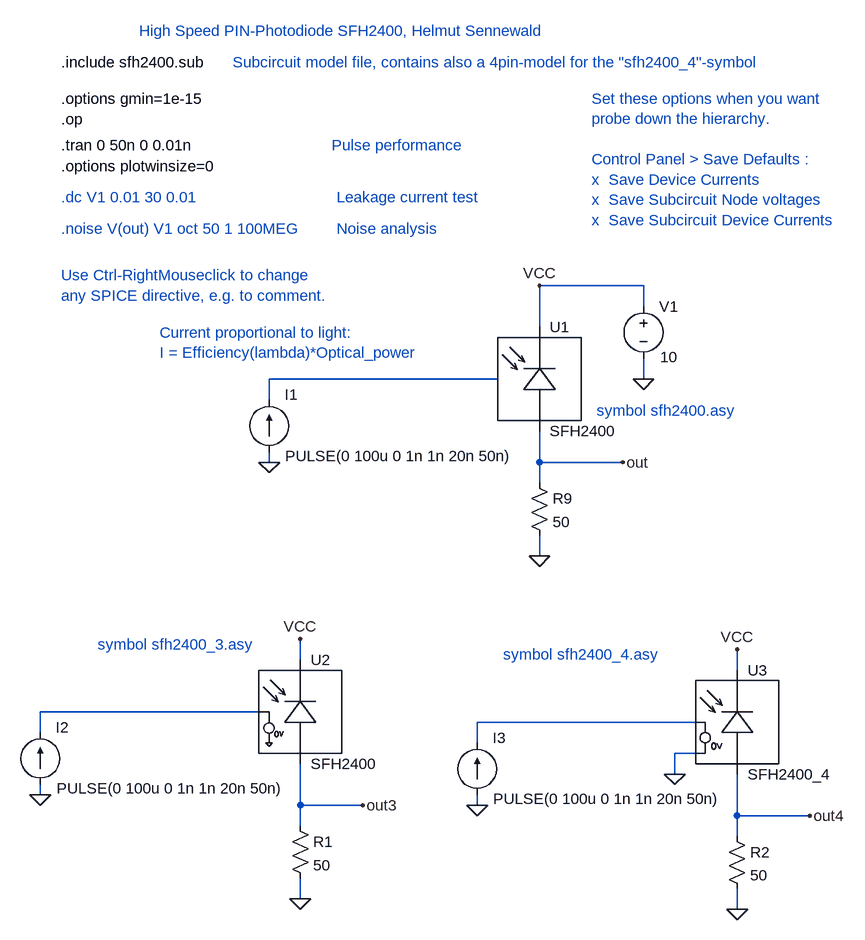
[diagram p0: schematic sfh2400_test1.asc]
sfh2400_test1.asc, the LTspice schematic file:
Version 4
SHEET 1 1668 1860
WIRE -1008 1072 -1008 1040
WIRE -1008 1168 -1008 1152
WIRE -672 1040 -1008 1040
WIRE -656 560 -656 528
WIRE -656 656 -656 640
WIRE -608 960 -608 928
WIRE -608 1184 -608 1120
WIRE -608 1216 -608 1184
WIRE -608 1328 -608 1296
WIRE -512 1184 -608 1184
WIRE -336 1088 -336 1056
WIRE -336 1184 -336 1168
WIRE -304 528 -656 528
WIRE -240 448 -240 384
WIRE -240 656 -240 608
WIRE -240 688 -240 656
WIRE -240 800 -240 768
WIRE -112 656 -240 656
WIRE -80 384 -240 384
WIRE -80 416 -80 384
WIRE -80 528 -80 496
WIRE -32 1136 -32 1104
WIRE 0 1056 -336 1056
WIRE 0 1104 -32 1104
WIRE 64 976 64 944
WIRE 64 1200 64 1136
WIRE 64 1232 64 1200
WIRE 64 1344 64 1312
WIRE 176 1200 64 1200
FLAG -80 528 0
FLAG -240 800 0
FLAG -112 656 out
FLAG -656 656 0
FLAG -240 384 VCC
FLAG 64 944 VCC
FLAG -608 928 VCC
FLAG -608 1328 0
FLAG -512 1184 out3
FLAG 64 1344 0
FLAG 176 1200 out4
FLAG -1008 1168 0
FLAG -336 1184 0
FLAG -32 1136 0
SYMBOL voltage -80 400 R0
WINDOW 123 24 44 Left 0
WINDOW 39 0 0 Left 0
WINDOW 3 26 94 Left 0
SYMATTR Value 10
SYMATTR InstName V1
SYMBOL res -256 672 R0
SYMATTR InstName R9
SYMATTR Value 50
SYMBOL current -656 640 M180
WINDOW 0 24 88 Left 0
WINDOW 3 25 -6 Left 0
WINDOW 123 0 0 Left 0
WINDOW 39 0 0 Left 0
SYMATTR InstName I1
SYMATTR Value PULSE(0 100u 0 1n 1n 20n 50n)
SYMBOL sfh2400 -240 528 R0
SYMATTR InstName U1
SYMBOL sfh2400_3 -608 1040 R0
SYMATTR InstName U2
SYMBOL sfh2400_4 64 1056 R0
SYMATTR InstName U3
SYMBOL res -624 1200 R0
SYMATTR InstName R1
SYMATTR Value 50
SYMBOL res 48 1216 R0
SYMATTR InstName R2
SYMATTR Value 50
SYMBOL current -1008 1152 M180
WINDOW 0 24 88 Left 0
WINDOW 3 25 -6 Left 0
WINDOW 123 0 0 Left 0
WINDOW 39 0 0 Left 0
SYMATTR InstName I2
SYMATTR Value PULSE(0 100u 0 1n 1n 20n 50n)
SYMBOL current -336 1168 M180
WINDOW 0 24 88 Left 0
WINDOW 3 25 -6 Left 0
WINDOW 123 0 0 Left 0
WINDOW 39 0 0 Left 0
SYMATTR InstName I3
SYMATTR Value PULSE(0 100u 0 1n 1n 20n 50n)
TEXT -976 128 Left 0 !.op
TEXT -976 96 Left 0 !.options gmin=1e-15
TEXT -976 296 Left 0 ;.noise V(out) V1 oct 50 1 100MEG
TEXT -976 168 Left 0 !.tran 0 50n 0 0.01n
TEXT -976 248 Left 0 ;.dc V1 0.01 30 0.01
TEXT -976 40 Left 0 !.include sfh2400.sub
TEXT -976 368 Left 0 ;Use Ctrl-RightMouseclick to change \nany SPICE directive, e.g. to comment.
TEXT -160 96 Left 0 ;Set these options when you want \nprobe down the hierarchy.\n \nControl Panel > Save Defaults : \nx  Save Device Currents\nx  Save Subcircuit Node voltages\nx  Save Subcircuit Device Currents
TEXT -856 -8 Left 0 ;High Speed PIN-Photodiode SFH2400, Helmut Sennewald
TEXT -824 456 Left 0 ;Current proportional to light:\nI = Efficiency(lambda)*Optical_power
TEXT -920 936 Left 0 ;symbol sfh2400_3.asy
TEXT -296 952 Left 0 ;symbol sfh2400_4.asy
TEXT -152 576 Left 0 ;symbol sfh2400.asy
TEXT -712 40 Left 0 ;Subcircuit model file, contains also a 4pin-model for the "sfh2400_4"-symbol
TEXT -560 168 Left 0 ;Pulse performance
TEXT -976 200 Left 0 !.options plotwinsize=0
TEXT -552 248 Left 0 ;Leakage current test
TEXT -552 296 Left 0 ;Noise analysis

The netlist it stands for:
* sfh2400_test1.asc
V1 VCC 0 10
R9 out 0 50
I1 0 N002 PULSE(0 100u 0 1n 1n 20n 50n)
XU1 out VCC N002 SFH2400  ; pins A K L
XU2 out3 VCC N001 SFH2400  ; pins A K L
XU3 out4 VCC N003 0 SFH2400_4  ; pins A K L G
R1 out3 0 50
R2 out4 0 50
I2 0 N001 PULSE(0 100u 0 1n 1n 20n 50n)
I3 0 N003 PULSE(0 100u 0 1n 1n 20n 50n)
.op
.options gmin=1e-15
* .noise V(out) V1 oct 50 1 100MEG
.tran 0 50n 0 0.01n
* .dc V1 0.01 30 0.01
.include sfh2400.sub
* Use Ctrl-RightMouseclick to change
* any SPICE directive, e.g. to comment.
* Set these options when you want
* probe down the hierarchy.
* Control Panel > Save Defaults :
* x  Save Device Currents
* x  Save Subcircuit Node voltages
* x  Save Subcircuit Device Currents
* High Speed PIN-Photodiode SFH2400, Helmut Sennewald
* Current proportional to light:
* I = Efficiency(lambda)*Optical_power
* symbol sfh2400_3.asy
* symbol sfh2400_4.asy
* symbol sfh2400.asy
* Subcircuit model file, contains also a 4pin-model for the "sfh2400_4"-symbol
* Pulse performance
.options plotwinsize=0
* Leakage current test
* Noise analysis
.backanno
.end